# Altium schematic sheet Signals.SchDoc
size A4
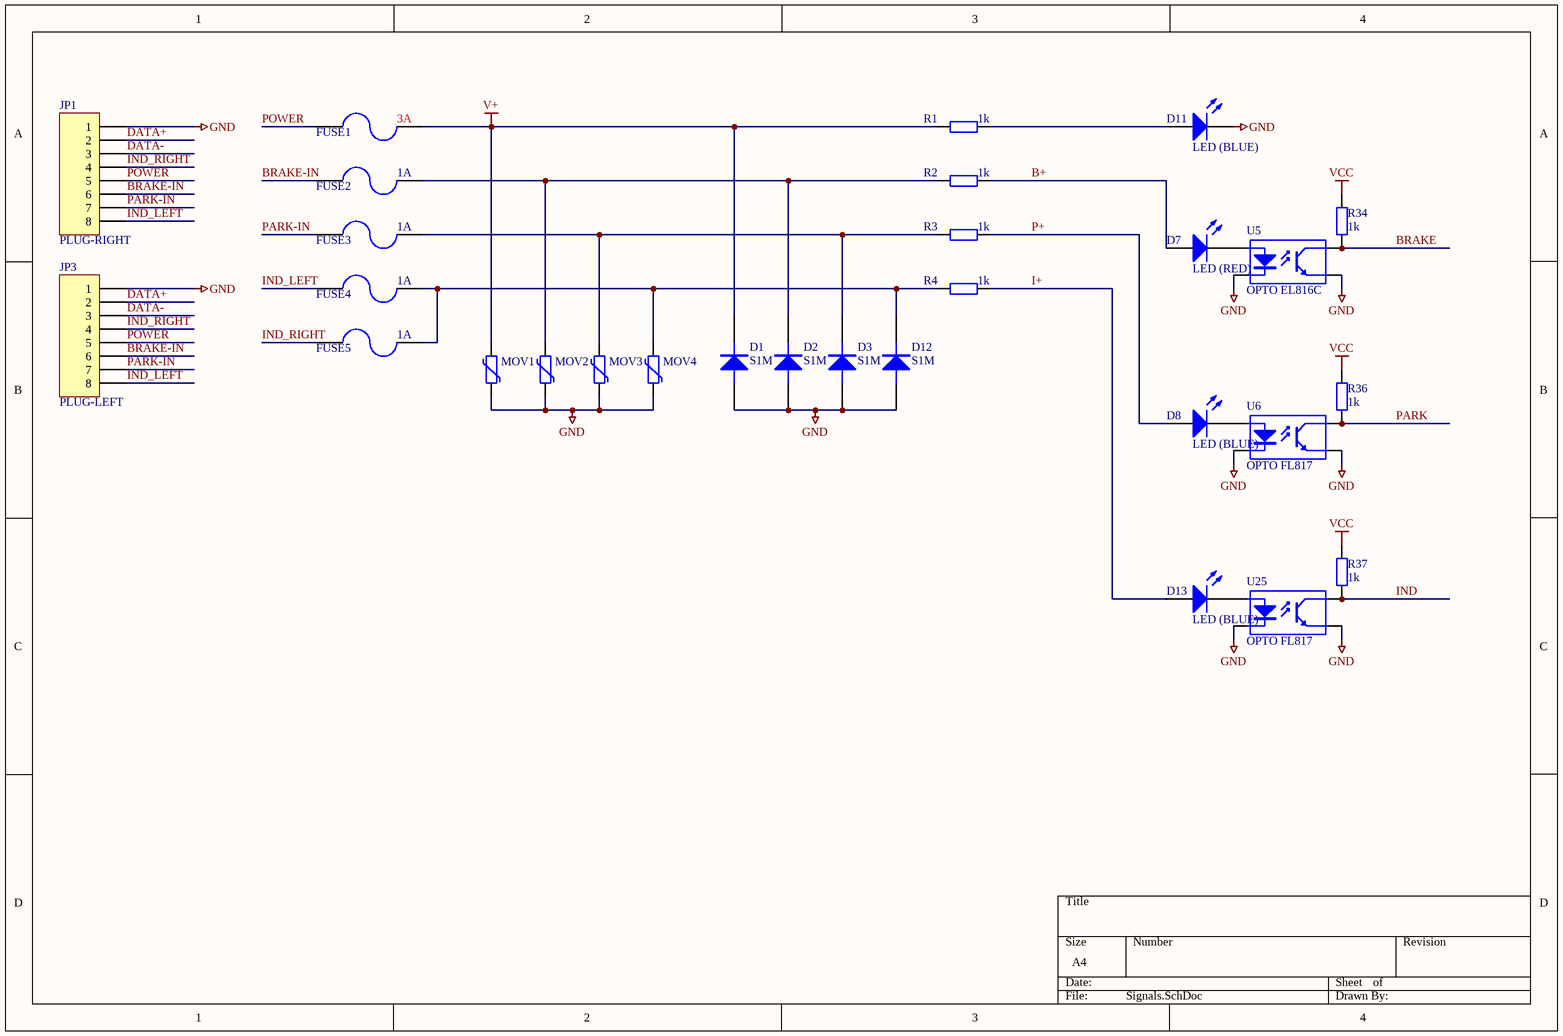
[diagram p0: Signals.SchDoc]

## Parts
D1  S1M  [DO-214AC]
D2  S1M  [DO-214AC]
D3  S1M  [DO-214AC]
D7  LED (RED)  [LED(3D) 3MM VERTICAL (GREEN)]
D8  LED (BLUE)  [LED(3D) 3MM VERTICAL (GREEN)]
D11  LED (BLUE)  [LED(3D) 3MM VERTICAL (GREEN)]
D12  S1M  [DO-214AC]
D13  LED (BLUE)  [LED(3D) 3MM VERTICAL (GREEN)]
FUSE1  3A  [miniSMD Polyswitch]
FUSE2  1A  [miniSMD Polyswitch]
FUSE3  1A  [miniSMD Polyswitch]
FUSE4  1A  [miniSMD Polyswitch]
FUSE5  1A  [miniSMD Polyswitch]
JP1  PLUG-RIGHT  [Molex 26013144 RA 8P Socket]
JP3  PLUG-LEFT  [Molex 26013144 RA 8P Socket]
MOV1  FTR FTR07D270K 22V  [MOV - 10mm]  (value not drawn)
MOV2  FTR FTR07D270K 22V  [MOV - 10mm]  (value not drawn)
MOV3  FTR FTR07D270K 22V  [MOV - 10mm]  (value not drawn)
MOV4  FTR FTR07D270K 22V  [MOV - 10mm]  (value not drawn)
R1  1k  [RESISTOR 0805]
R2  1k  [RESISTOR 0805]
R3  1k  [RESISTOR 0805]
R4  1k  [RESISTOR 0805]
R34  1k  [RESISTOR 0805]
R36  1k  [RESISTOR 0805]
R37  1k  [RESISTOR 0805]
U5  OPTO EL816C  [DIP_4]
U6  OPTO FL817  [DIP_4]
U25  OPTO FL817  [DIP_4]

## Nets
GND: D1.1(A) D2.1(A) D3.1(A) D11.2(K) D12.1(A) JP1.1 JP3.1 MOV1.2 MOV2.2 MOV3.2 MOV4.2 U5.2(K) U5.3(E) U6.2(K) U6.3(E) U25.2(K) U25.3(E)
V+: D1.2(K) FUSE1.2 MOV1.1 R1.2
VCC: R34.1 R36.1 R37.1
B+: D7.1(A) R2.1
BRAKE: R34.2 U5.4(C)
BRAKE-IN: FUSE2.1 JP1.6 JP3.6
DATA+: JP1.2 JP3.2
DATA-: JP1.3 JP3.3
I+: D13.1(A) R4.1
IND: R37.2 U25.4(C)
IND_LEFT: FUSE4.1 JP1.8 JP3.8
IND_RIGHT: FUSE5.1 JP1.4 JP3.4
P+: D8.1(A) R3.1
PARK: R36.2 U6.4(C)
PARK-IN: FUSE3.1 JP1.7 JP3.7
POWER: FUSE1.1 JP1.5 JP3.5
NetD2_2: D2.2(K) FUSE2.2 MOV2.1 R2.2
NetD3_2: D3.2(K) FUSE3.2 MOV3.1 R3.2
NetD7_2: D7.2(K) U5.1(A)
NetD8_2: D8.2(K) U6.1(A)
NetD11_1: D11.1(A) R1.1
NetD12_2: D12.2(K) FUSE4.2 FUSE5.2 MOV4.1 R4.2
NetD13_2: D13.2(K) U25.1(A)

## Library data of the parts
D1-D3 D12 = DIODE: DIODE, POWER; Manufacturer: Taiwan Semiconductor; Mouser Part no.: 821-S1M; Manufacturer Part No.: S1M; value: S1M; Web link: http://au.mouser.com/ProductDetail/Taiwan-Semiconductor/S1M/?qs=sGAEpiMZZMtEwUVCuofpuOlSmRjzJonf%252bmrIm0%252bGbjE%3d
D7 D8 D11 D13 = LED 3mm RED: 3mm RED LED; Manufacturer: Kingbright; Manufacturer Part No.: WP132XIT; Mouser Part no.: 604-WP132XIT; Farnell Part no.: 1003393; Web link: http://au.mouser.com/Search/Refine.aspx?Keyword=604-WP132XIT
FUSE1-FUSE5 = POLYSWITCH 500mA: POLYSWITCH 1A; Manufacturer: Tyco Electronics / Raychem; Manufacturer Part No.: MINISMDC050F-2; Mouser Part no.: 650-MINISMDC050F-2; Farnell Part no.: 1175839; Web link: http://au.mouser.com/ProductDetail/Tyco-Electronics-Raychem/MINISMDC050F-2/?qs=sGAEpiMZZMu7EFbsM1w0neRfX3mrvYIvOpkrchiUGng%3d
JP1 JP3 = Header 8: HEADER, 8 WAY; Value: MOLEX 26013144; Revision: July-2002: Re-released for DXP Platform.
MOV1-MOV4 = VARISTOR: Value: FTR FTR07D270K 22V
R1-R4 R34 R36 R37 = Res2: Resistor; Published: 8-Jun-2000; LatestRevisionDate: 17-Jul-2002; LatestRevisionNote: Re-released for DXP Platform.; PackageReference: AXIAL-0.4; Publisher: Altium Limited; PackageDescription: Axial Device, Thru-Hole; 2 Leads; 0.4 in Pin Spacing; Value: 1k
U5 U6 U25 = FL817: 4-Pin Phototransistor Optocoupler
  U5: LCSC Part Number: C181880